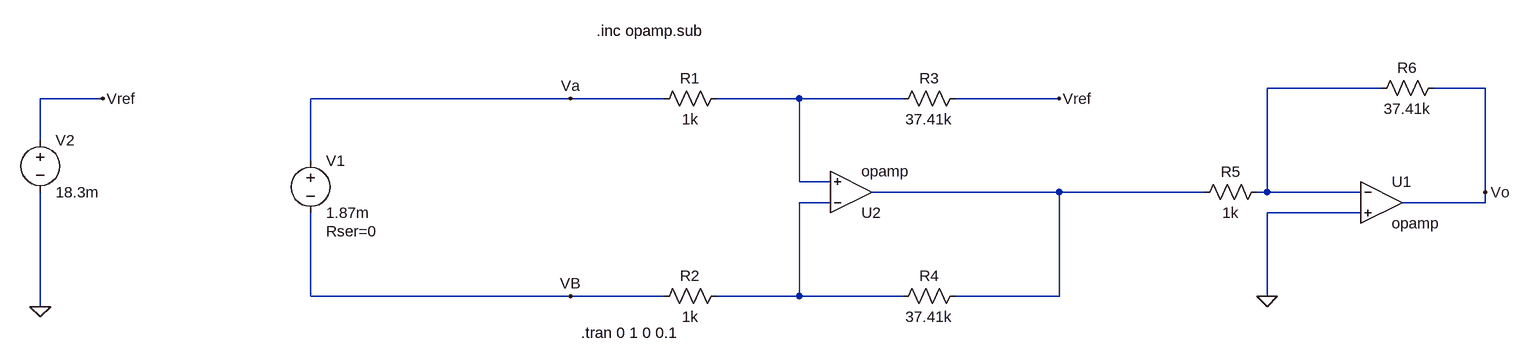
[diagram p0: schematic esquematico_ideal.asc]
esquematico_ideal.asc, the LTspice schematic file:
Version 4.1
SHEET 1 1496 680
WIRE 1232 96 1056 96
WIRE 1392 96 1312 96
WIRE -736 112 -832 112
WIRE -16 112 -416 112
WIRE 128 112 -16 112
WIRE 336 112 208 112
WIRE 496 112 336 112
WIRE 736 112 576 112
WIRE -832 176 -832 112
WIRE -416 208 -416 112
WIRE 336 240 336 112
WIRE 384 240 336 240
WIRE 736 256 448 256
WIRE 960 256 736 256
WIRE 1056 256 1056 96
WIRE 1056 256 1040 256
WIRE 1200 256 1056 256
WIRE 1392 256 1392 96
WIRE 384 272 336 272
WIRE 1392 272 1392 256
WIRE 1392 272 1264 272
WIRE 1200 288 1056 288
WIRE -416 416 -416 288
WIRE -16 416 -416 416
WIRE 128 416 -16 416
WIRE 336 416 336 272
WIRE 336 416 208 416
WIRE 496 416 336 416
WIRE 736 416 736 256
WIRE 736 416 576 416
WIRE 1056 416 1056 288
WIRE -832 432 -832 256
FLAG 1056 416 0
FLAG -16 112 Va
FLAG -16 416 VB
FLAG 1392 256 Vo
FLAG 736 112 Vref
FLAG -832 432 0
FLAG -736 112 Vref
DATAFLAG 608 256 ""
DATAFLAG 1392 272 ""
SYMBOL res 224 96 R90
WINDOW 0 0 56 VBottom 2
WINDOW 3 32 56 VTop 2
SYMATTR InstName R1
SYMATTR Value 1k
SYMBOL res 224 400 R90
WINDOW 0 0 56 VBottom 2
WINDOW 3 32 56 VTop 2
SYMATTR InstName R2
SYMATTR Value 1k
SYMBOL res 592 96 R90
WINDOW 0 0 56 VBottom 2
WINDOW 3 32 56 VTop 2
SYMATTR InstName R3
SYMATTR Value 37.41k
SYMBOL res 592 400 R90
WINDOW 0 0 56 VBottom 2
WINDOW 3 32 56 VTop 2
SYMATTR InstName R4
SYMATTR Value 37.41k
SYMBOL res 1056 240 R90
WINDOW 0 0 56 VBottom 2
WINDOW 3 32 56 VTop 2
SYMATTR InstName R5
SYMATTR Value 1k
SYMBOL res 1328 80 R90
WINDOW 0 0 56 VBottom 2
WINDOW 3 32 56 VTop 2
SYMATTR InstName R6
SYMATTR Value 37.41k
SYMBOL voltage -416 192 R0
WINDOW 123 0 0 Left 0
WINDOW 39 24 124 Left 2
SYMATTR InstName V1
SYMATTR Value 1.87m
SYMATTR SpiceLine Rser=0
SYMBOL OpAmps\\opamp 1232 208 R0
SYMATTR InstName U1
SYMBOL OpAmps\\opamp 416 320 M180
SYMATTR InstName U2
SYMBOL voltage -832 160 R0
WINDOW 123 0 0 Left 0
WINDOW 39 0 0 Left 0
SYMATTR InstName V2
SYMATTR Value 18.3m
TEXT 24 8 Left 2 !.inc opamp.sub
TEXT 0 472 Left 2 !.tran 0 1 0 0.1

The netlist it stands for:
* esquematico_ideal.asc
R1 N002 Va 1k
R2 N004 VB 1k
R3 Vref N002 37.41k
R4 N003 N004 37.41k
R5 N001 N003 1k
R6 Vo N001 37.41k
V1 Va VB 1.87m Rser=0
X§U1 N001 0 Vo opamp Aol=100K GBW=10Meg  ; pins invin noninvin out
X§U2 N004 N002 N003 opamp Aol=100K GBW=10Meg  ; pins invin noninvin out
V2 Vref 0 18.3m
.inc opamp.sub
.tran 0 1 0 0.1
.backanno
.end